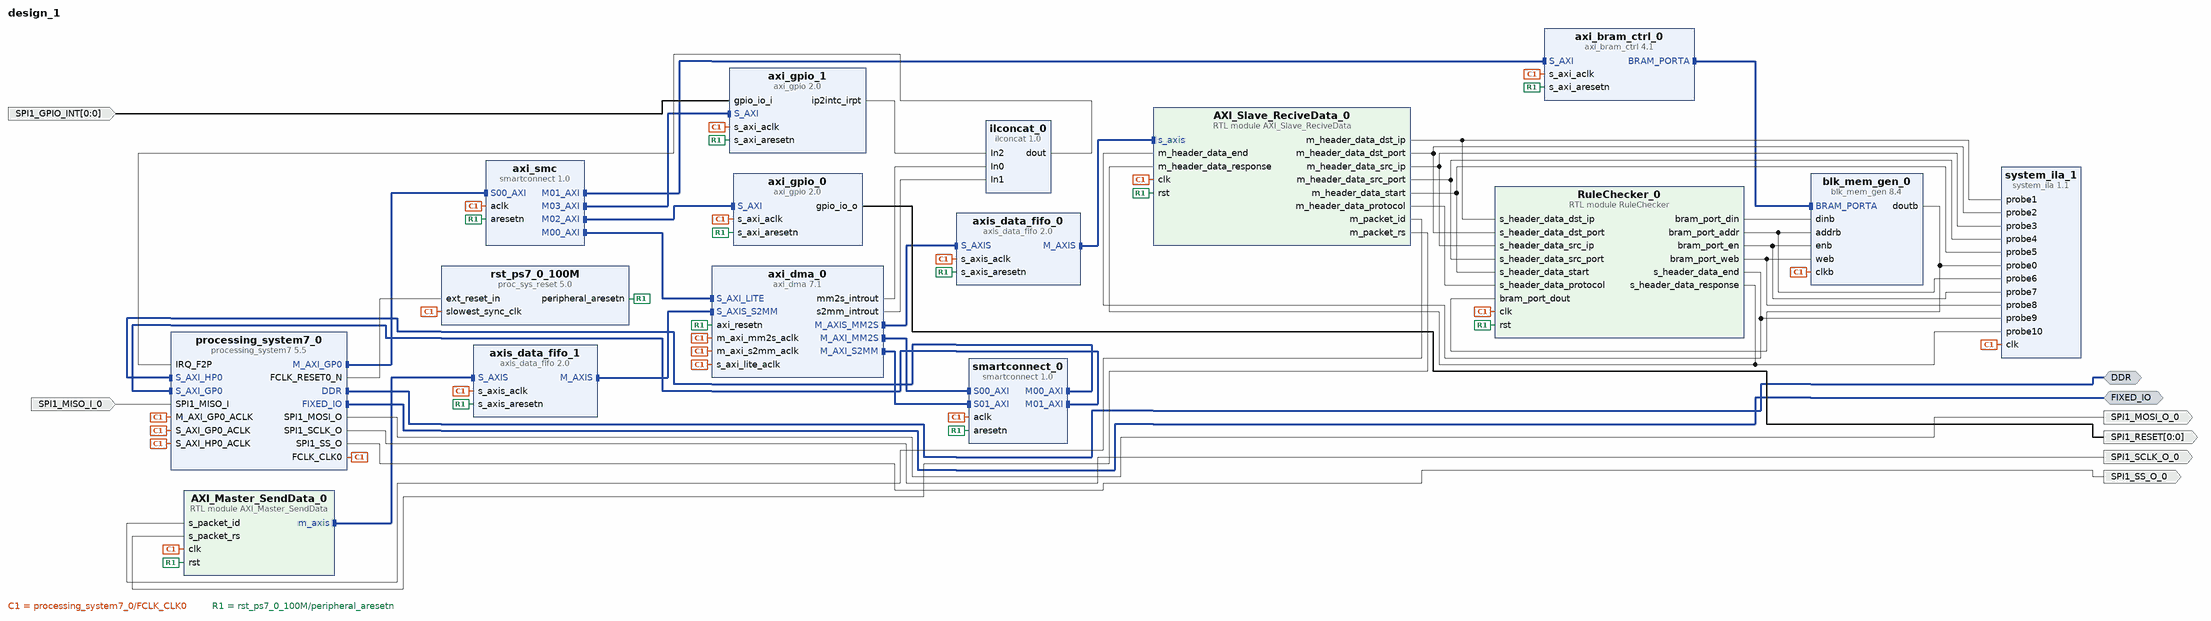
[diagram p0: block diagram of the top level]
# Vivado block design design_1, xc7z020clg400-1, Vivado 2025.1
create_bd_design design_1

create_bd_intf_port -mode Master -vlnv xilinx.com:interface:ddrx_rtl:1.0 DDR
create_bd_intf_port -mode Master -vlnv xilinx.com:display_processing_system7:fixedio_rtl:1.0 FIXED_IO
create_bd_port -dir O SPI1_SCLK_O_0
create_bd_port -dir O SPI1_MOSI_O_0
create_bd_port -dir O SPI1_SS_O_0
create_bd_port -dir O -from 0 -to 0 SPI1_RESET
create_bd_port -dir I -from 0 -to 0 SPI1_GPIO_INT
create_bd_port -dir I SPI1_MISO_I_0

create_bd_cell -type ip -vlnv xilinx.com:ip:processing_system7:5.5 processing_system7_0
set_property -dict [list \
  CONFIG.PCW_APU_PERIPHERAL_FREQMHZ 650 \
  CONFIG.PCW_CRYSTAL_PERIPHERAL_FREQMHZ 50 \
  CONFIG.PCW_ENET0_ENET0_IO {MIO 16 .. 27} \
  CONFIG.PCW_ENET0_GRP_MDIO_ENABLE 1 \
  CONFIG.PCW_ENET0_GRP_MDIO_IO {MIO 52 .. 53} \
  CONFIG.PCW_ENET0_PERIPHERAL_ENABLE 1 \
  CONFIG.PCW_ENET0_RESET_ENABLE 1 \
  CONFIG.PCW_ENET0_RESET_IO {MIO 9} \
  CONFIG.PCW_ENET_RESET_ENABLE 1 \
  CONFIG.PCW_ENET_RESET_SELECT {Share reset pin} \
  CONFIG.PCW_FPGA0_PERIPHERAL_FREQMHZ 100 \
  CONFIG.PCW_FPGA1_PERIPHERAL_FREQMHZ 50 \
  CONFIG.PCW_GPIO_MIO_GPIO_ENABLE 1 \
  CONFIG.PCW_GPIO_MIO_GPIO_IO MIO \
  CONFIG.PCW_I2C_RESET_ENABLE 1 \
  CONFIG.PCW_IRQ_F2P_INTR 1 \
  CONFIG.PCW_M_AXI_GP0_FREQMHZ 10 \
  CONFIG.PCW_PERIPHERAL_BOARD_PRESET part0 \
  CONFIG.PCW_PRESET_BANK1_VOLTAGE {LVCMOS 1.8V} \
  CONFIG.PCW_QSPI_GRP_FBCLK_ENABLE 1 \
  CONFIG.PCW_QSPI_GRP_FBCLK_IO {MIO 8} \
  CONFIG.PCW_QSPI_GRP_SINGLE_SS_ENABLE 1 \
  CONFIG.PCW_QSPI_GRP_SINGLE_SS_IO {MIO 1 .. 6} \
  CONFIG.PCW_QSPI_PERIPHERAL_ENABLE 1 \
  CONFIG.PCW_QSPI_QSPI_IO {MIO 1 .. 6} \
  CONFIG.PCW_SD0_GRP_CD_ENABLE 1 \
  CONFIG.PCW_SD0_GRP_CD_IO {MIO 47} \
  CONFIG.PCW_SD0_GRP_WP_ENABLE 0 \
  CONFIG.PCW_SD0_PERIPHERAL_ENABLE 1 \
  CONFIG.PCW_SD0_SD0_IO {MIO 40 .. 45} \
  CONFIG.PCW_SDIO_PERIPHERAL_FREQMHZ 50 \
  CONFIG.PCW_SINGLE_QSPI_DATA_MODE x4 \
  CONFIG.PCW_SPI1_PERIPHERAL_ENABLE 1 \
  CONFIG.PCW_SPI1_SPI1_IO EMIO \
  CONFIG.PCW_UART0_PERIPHERAL_ENABLE 1 \
  CONFIG.PCW_UART0_UART0_IO {MIO 14 .. 15} \
  CONFIG.PCW_UART1_PERIPHERAL_ENABLE 0 \
  CONFIG.PCW_UART_PERIPHERAL_FREQMHZ 100 \
  CONFIG.PCW_UIPARAM_DDR_BUS_WIDTH {16 Bit} \
  CONFIG.PCW_UIPARAM_DDR_FREQ_MHZ 525 \
  CONFIG.PCW_UIPARAM_DDR_PARTNO {MT41J256M16 RE-125} \
  CONFIG.PCW_USB0_PERIPHERAL_ENABLE 1 \
  CONFIG.PCW_USB0_RESET_ENABLE 1 \
  CONFIG.PCW_USB0_RESET_IO {MIO 46} \
  CONFIG.PCW_USB0_USB0_IO {MIO 28 .. 39} \
  CONFIG.PCW_USB_RESET_ENABLE 1 \
  CONFIG.PCW_USB_RESET_SELECT {Share reset pin} \
  CONFIG.PCW_USE_FABRIC_INTERRUPT 1 \
  CONFIG.PCW_USE_S_AXI_GP0 1 \
  CONFIG.PCW_USE_S_AXI_HP0 1 \
  CONFIG.preset None \
] [get_bd_cells processing_system7_0]
# 511 more settings of processing_system7_0 are not shown: defaults, MIO pin electricals, DDR timing, and values the tool derives
create_bd_cell -type ip -vlnv xilinx.com:ip:axi_dma:7.1 axi_dma_0
set_property -dict {CONFIG.c_include_s2mm 1 CONFIG.c_include_sg 0} [get_bd_cells axi_dma_0]
create_bd_cell -type ip -vlnv xilinx.com:ip:smartconnect:1.0 axi_smc
set_property -dict {CONFIG.NUM_MI 4 CONFIG.NUM_SI 1} [get_bd_cells axi_smc]
create_bd_cell -type ip -vlnv xilinx.com:ip:proc_sys_reset:5.0 rst_ps7_0_100M
create_bd_cell -type ip -vlnv xilinx.com:ip:smartconnect:1.0 smartconnect_0
set_property -dict {CONFIG.NUM_MI 2 CONFIG.NUM_SI 2} [get_bd_cells smartconnect_0]
create_bd_cell -type module -reference AXI_Slave_ReciveData AXI_Slave_ReciveData_0
create_bd_cell -type module -reference RuleChecker RuleChecker_0
create_bd_cell -type ip -vlnv xilinx.com:ip:axi_bram_ctrl:4.1 axi_bram_ctrl_0
set_property -dict {CONFIG.READ_LATENCY 2 CONFIG.SINGLE_PORT_BRAM 1} [get_bd_cells axi_bram_ctrl_0]
create_bd_cell -type ip -vlnv xilinx.com:ip:blk_mem_gen:8.4 blk_mem_gen_0
set_property -dict [list \
  CONFIG.Assume_Synchronous_Clk true \
  CONFIG.Memory_Type True_Dual_Port_RAM \
  CONFIG.Operating_Mode_B READ_FIRST \
  CONFIG.use_bram_block Stand_Alone \
] [get_bd_cells blk_mem_gen_0]
create_bd_cell -type ip -vlnv xilinx.com:ip:axis_data_fifo:2.0 axis_data_fifo_0
create_bd_cell -type ip -vlnv xilinx.com:ip:axis_data_fifo:2.0 axis_data_fifo_1
set_property -dict {CONFIG.HAS_TLAST 1 CONFIG.TDATA_NUM_BYTES 4} [get_bd_cells axis_data_fifo_1]
create_bd_cell -type module -reference AXI_Master_SendData AXI_Master_SendData_0
create_bd_cell -type inline_hdl -vlnv xilinx.com:inline_hdl:ilconcat:1.0 ilconcat_0
set_property -dict {CONFIG.NUM_PORTS 3} [get_bd_cells ilconcat_0]
create_bd_cell -type ip -vlnv xilinx.com:ip:axi_gpio:2.0 axi_gpio_0
set_property -dict [list \
  CONFIG.C_ALL_OUTPUTS 1 \
  CONFIG.C_DOUT_DEFAULT 0x00000001 \
  CONFIG.C_GPIO_WIDTH 1 \
  CONFIG.C_INTERRUPT_PRESENT 0 \
] [get_bd_cells axi_gpio_0]
create_bd_cell -type ip -vlnv xilinx.com:ip:axi_gpio:2.0 axi_gpio_1
set_property -dict {CONFIG.C_ALL_INPUTS 1 CONFIG.C_GPIO_WIDTH 1 CONFIG.C_INTERRUPT_PRESENT 1} [get_bd_cells axi_gpio_1]
create_bd_cell -type ip -vlnv xilinx.com:ip:system_ila:1.1 system_ila_1
set_property -dict [list \
  CONFIG.C_MON_TYPE NATIVE \
  CONFIG.C_NUM_OF_PROBES 11 \
  CONFIG.C_PROBE0_TYPE 0 \
  CONFIG.C_PROBE10_TYPE 0 \
  CONFIG.C_PROBE1_TYPE 0 \
  CONFIG.C_PROBE2_TYPE 0 \
  CONFIG.C_PROBE3_TYPE 0 \
  CONFIG.C_PROBE4_TYPE 0 \
  CONFIG.C_PROBE5_TYPE 0 \
  CONFIG.C_PROBE6_TYPE 0 \
  CONFIG.C_PROBE7_TYPE 0 \
  CONFIG.C_PROBE8_TYPE 0 \
  CONFIG.C_PROBE9_TYPE 0 \
] [get_bd_cells system_ila_1]

# ---- connections ----

connect_bd_intf_net [get_bd_intf_pins AXI_Master_SendData_0/m_axis] [get_bd_intf_pins axis_data_fifo_1/S_AXIS]
connect_bd_intf_net [get_bd_intf_pins axi_bram_ctrl_0/BRAM_PORTA] [get_bd_intf_pins blk_mem_gen_0/BRAM_PORTA]
connect_bd_intf_net [get_bd_intf_pins axi_dma_0/M_AXIS_MM2S] [get_bd_intf_pins axis_data_fifo_0/S_AXIS]
connect_bd_intf_net [get_bd_intf_pins axi_dma_0/M_AXI_MM2S] [get_bd_intf_pins smartconnect_0/S00_AXI]
connect_bd_intf_net [get_bd_intf_pins axi_dma_0/M_AXI_S2MM] [get_bd_intf_pins smartconnect_0/S01_AXI]
connect_bd_intf_net -intf_net axi_fifo_mm_s_0_AXI_STR_TXD [get_bd_intf_pins axis_data_fifo_0/M_AXIS] [get_bd_intf_pins AXI_Slave_ReciveData_0/s_axis]
connect_bd_intf_net [get_bd_intf_pins axi_smc/M00_AXI] [get_bd_intf_pins axi_dma_0/S_AXI_LITE]
connect_bd_intf_net [get_bd_intf_pins axi_smc/M01_AXI] [get_bd_intf_pins axi_bram_ctrl_0/S_AXI]
connect_bd_intf_net [get_bd_intf_pins axi_smc/M02_AXI] [get_bd_intf_pins axi_gpio_0/S_AXI]
connect_bd_intf_net [get_bd_intf_pins axi_smc/M03_AXI] [get_bd_intf_pins axi_gpio_1/S_AXI]
connect_bd_intf_net [get_bd_intf_pins axi_dma_0/S_AXIS_S2MM] [get_bd_intf_pins axis_data_fifo_1/M_AXIS]
connect_bd_intf_net [get_bd_intf_ports DDR] [get_bd_intf_pins processing_system7_0/DDR]
connect_bd_intf_net [get_bd_intf_ports FIXED_IO] [get_bd_intf_pins processing_system7_0/FIXED_IO]
connect_bd_intf_net [get_bd_intf_pins processing_system7_0/M_AXI_GP0] [get_bd_intf_pins axi_smc/S00_AXI]
connect_bd_intf_net [get_bd_intf_pins smartconnect_0/M00_AXI] [get_bd_intf_pins processing_system7_0/S_AXI_HP0]
connect_bd_intf_net [get_bd_intf_pins smartconnect_0/M01_AXI] [get_bd_intf_pins processing_system7_0/S_AXI_GP0]
connect_bd_net -net AXI_Slave_ReciveData_0_m_header_data_dst_ip [get_bd_pins AXI_Slave_ReciveData_0/m_header_data_dst_ip] \
  [get_bd_pins RuleChecker_0/s_header_data_dst_ip] [get_bd_pins system_ila_1/probe1]
connect_bd_net -net AXI_Slave_ReciveData_0_m_header_data_dst_port [get_bd_pins AXI_Slave_ReciveData_0/m_header_data_dst_port] \
  [get_bd_pins RuleChecker_0/s_header_data_dst_port] [get_bd_pins system_ila_1/probe2]
connect_bd_net [get_bd_pins AXI_Slave_ReciveData_0/m_header_data_protocol] [get_bd_pins RuleChecker_0/s_header_data_protocol]
connect_bd_net -net AXI_Slave_ReciveData_0_m_header_data_src_ip [get_bd_pins AXI_Slave_ReciveData_0/m_header_data_src_ip] \
  [get_bd_pins RuleChecker_0/s_header_data_src_ip] [get_bd_pins system_ila_1/probe3]
connect_bd_net -net AXI_Slave_ReciveData_0_m_header_data_src_port [get_bd_pins AXI_Slave_ReciveData_0/m_header_data_src_port] \
  [get_bd_pins RuleChecker_0/s_header_data_src_port] [get_bd_pins system_ila_1/probe4]
connect_bd_net -net AXI_Slave_ReciveData_0_m_header_data_start [get_bd_pins AXI_Slave_ReciveData_0/m_header_data_start] \
  [get_bd_pins RuleChecker_0/s_header_data_start] [get_bd_pins system_ila_1/probe5]
connect_bd_net [get_bd_pins AXI_Slave_ReciveData_0/m_packet_id] [get_bd_pins AXI_Master_SendData_0/s_packet_id]
connect_bd_net [get_bd_pins AXI_Slave_ReciveData_0/m_packet_rs] [get_bd_pins AXI_Master_SendData_0/s_packet_rs]
connect_bd_net -net RuleChecker_0_bram_port_addr [get_bd_pins RuleChecker_0/bram_port_addr] \
  [get_bd_pins blk_mem_gen_0/addrb] [get_bd_pins system_ila_1/probe6]
connect_bd_net [get_bd_pins RuleChecker_0/bram_port_din] [get_bd_pins blk_mem_gen_0/dinb]
connect_bd_net -net RuleChecker_0_bram_port_en [get_bd_pins RuleChecker_0/bram_port_en] \
  [get_bd_pins blk_mem_gen_0/enb] [get_bd_pins system_ila_1/probe7]
connect_bd_net -net RuleChecker_0_bram_port_web [get_bd_pins RuleChecker_0/bram_port_web] \
  [get_bd_pins blk_mem_gen_0/web] [get_bd_pins system_ila_1/probe8]
connect_bd_net -net RuleChecker_0_s_header_data_end [get_bd_pins RuleChecker_0/s_header_data_end] \
  [get_bd_pins AXI_Slave_ReciveData_0/m_header_data_end] [get_bd_pins system_ila_1/probe9]
connect_bd_net -net RuleChecker_0_s_header_data_response [get_bd_pins RuleChecker_0/s_header_data_response] \
  [get_bd_pins AXI_Slave_ReciveData_0/m_header_data_response] [get_bd_pins system_ila_1/probe10]
connect_bd_net [get_bd_ports SPI1_GPIO_INT] [get_bd_pins axi_gpio_1/gpio_io_i]
connect_bd_net -net SPI1_MISO_I_0_1 [get_bd_ports SPI1_MISO_I_0] [get_bd_pins processing_system7_0/SPI1_MISO_I]
connect_bd_net [get_bd_pins axi_dma_0/mm2s_introut] [get_bd_pins ilconcat_0/In0]
connect_bd_net [get_bd_pins axi_dma_0/s2mm_introut] [get_bd_pins ilconcat_0/In1]
connect_bd_net [get_bd_pins axi_gpio_0/gpio_io_o] [get_bd_ports SPI1_RESET]
connect_bd_net [get_bd_pins axi_gpio_1/ip2intc_irpt] [get_bd_pins ilconcat_0/In2]
connect_bd_net -net blk_mem_gen_0_doutb [get_bd_pins blk_mem_gen_0/doutb] [get_bd_pins RuleChecker_0/bram_port_dout] [get_bd_pins system_ila_1/probe0]
connect_bd_net [get_bd_pins ilconcat_0/dout] [get_bd_pins processing_system7_0/IRQ_F2P]
connect_bd_net [get_bd_pins processing_system7_0/FCLK_CLK0] \
  [get_bd_pins processing_system7_0/M_AXI_GP0_ACLK] [get_bd_pins axi_smc/aclk] [get_bd_pins axi_dma_0/s_axi_lite_aclk] \
  [get_bd_pins rst_ps7_0_100M/slowest_sync_clk] [get_bd_pins axi_dma_0/m_axi_mm2s_aclk] \
  [get_bd_pins processing_system7_0/S_AXI_GP0_ACLK] [get_bd_pins processing_system7_0/S_AXI_HP0_ACLK] \
  [get_bd_pins smartconnect_0/aclk] [get_bd_pins axi_bram_ctrl_0/s_axi_aclk] [get_bd_pins blk_mem_gen_0/clkb] \
  [get_bd_pins axis_data_fifo_0/s_axis_aclk] [get_bd_pins axi_dma_0/m_axi_s2mm_aclk] \
  [get_bd_pins axis_data_fifo_1/s_axis_aclk] [get_bd_pins AXI_Master_SendData_0/clk] [get_bd_pins axi_gpio_0/s_axi_aclk] \
  [get_bd_pins axi_gpio_1/s_axi_aclk] [get_bd_pins AXI_Slave_ReciveData_0/clk] [get_bd_pins RuleChecker_0/clk] \
  [get_bd_pins system_ila_1/clk]
connect_bd_net [get_bd_pins processing_system7_0/FCLK_RESET0_N] [get_bd_pins rst_ps7_0_100M/ext_reset_in]
connect_bd_net [get_bd_pins processing_system7_0/SPI1_MOSI_O] [get_bd_ports SPI1_MOSI_O_0]
connect_bd_net [get_bd_pins processing_system7_0/SPI1_SCLK_O] [get_bd_ports SPI1_SCLK_O_0]
connect_bd_net [get_bd_pins processing_system7_0/SPI1_SS_O] [get_bd_ports SPI1_SS_O_0]
connect_bd_net [get_bd_pins rst_ps7_0_100M/peripheral_aresetn] \
  [get_bd_pins axi_dma_0/axi_resetn] [get_bd_pins axi_smc/aresetn] [get_bd_pins smartconnect_0/aresetn] \
  [get_bd_pins axi_bram_ctrl_0/s_axi_aresetn] [get_bd_pins axis_data_fifo_0/s_axis_aresetn] \
  [get_bd_pins axis_data_fifo_1/s_axis_aresetn] [get_bd_pins AXI_Master_SendData_0/rst] \
  [get_bd_pins axi_gpio_0/s_axi_aresetn] [get_bd_pins axi_gpio_1/s_axi_aresetn] [get_bd_pins AXI_Slave_ReciveData_0/rst] \
  [get_bd_pins RuleChecker_0/rst]
set_property HDL_ATTRIBUTE.BMM_INFO_PROCESSOR {arm > design_1 axi_bram_ctrl_0} [get_bd_cells processing_system7_0]
set_property HDL_ATTRIBUTE.KEEP_HIERARCHY yes [get_bd_cells processing_system7_0]
set_property HDL_ATTRIBUTE.BMM_INFO_ADDRESS_SPACE {byte  0x40000000 32 > design_1 blk_mem_gen_0} [get_bd_cells axi_bram_ctrl_0]
set_property HDL_ATTRIBUTE.KEEP_HIERARCHY yes [get_bd_cells axi_bram_ctrl_0]
set_property HDL_ATTRIBUTE.DEBUG true [get_bd_nets AXI_Slave_ReciveData_0_m_header_data_dst_ip]
set_property HDL_ATTRIBUTE.MARK_DEBUG true [get_bd_nets AXI_Slave_ReciveData_0_m_header_data_dst_ip]
set_property HDL_ATTRIBUTE.DEBUG true [get_bd_nets AXI_Slave_ReciveData_0_m_header_data_dst_port]
set_property HDL_ATTRIBUTE.MARK_DEBUG true [get_bd_nets AXI_Slave_ReciveData_0_m_header_data_dst_port]
set_property HDL_ATTRIBUTE.DEBUG true [get_bd_nets AXI_Slave_ReciveData_0_m_header_data_src_ip]
set_property HDL_ATTRIBUTE.MARK_DEBUG true [get_bd_nets AXI_Slave_ReciveData_0_m_header_data_src_ip]
set_property HDL_ATTRIBUTE.DEBUG true [get_bd_nets AXI_Slave_ReciveData_0_m_header_data_src_port]
set_property HDL_ATTRIBUTE.MARK_DEBUG true [get_bd_nets AXI_Slave_ReciveData_0_m_header_data_src_port]
set_property HDL_ATTRIBUTE.DEBUG true [get_bd_nets AXI_Slave_ReciveData_0_m_header_data_start]
set_property HDL_ATTRIBUTE.MARK_DEBUG true [get_bd_nets AXI_Slave_ReciveData_0_m_header_data_start]
set_property HDL_ATTRIBUTE.DEBUG true [get_bd_nets RuleChecker_0_bram_port_addr]
set_property HDL_ATTRIBUTE.MARK_DEBUG true [get_bd_nets RuleChecker_0_bram_port_addr]
set_property HDL_ATTRIBUTE.DEBUG true [get_bd_nets RuleChecker_0_bram_port_en]
set_property HDL_ATTRIBUTE.MARK_DEBUG true [get_bd_nets RuleChecker_0_bram_port_en]
set_property HDL_ATTRIBUTE.DEBUG true [get_bd_nets RuleChecker_0_bram_port_web]
set_property HDL_ATTRIBUTE.MARK_DEBUG true [get_bd_nets RuleChecker_0_bram_port_web]
set_property HDL_ATTRIBUTE.DEBUG true [get_bd_nets RuleChecker_0_s_header_data_end]
set_property HDL_ATTRIBUTE.MARK_DEBUG true [get_bd_nets RuleChecker_0_s_header_data_end]
set_property HDL_ATTRIBUTE.DEBUG true [get_bd_nets RuleChecker_0_s_header_data_response]
set_property HDL_ATTRIBUTE.MARK_DEBUG true [get_bd_nets RuleChecker_0_s_header_data_response]
set_property HDL_ATTRIBUTE.DEBUG true [get_bd_nets blk_mem_gen_0_doutb]
set_property HDL_ATTRIBUTE.MARK_DEBUG true [get_bd_nets blk_mem_gen_0_doutb]

# ---- address map ----
assign_bd_address -offset 0x00000000 -range 256M -target_address_space [get_bd_addr_spaces axi_dma_0/Data_MM2S] [get_bd_addr_segs processing_system7_0/S_AXI_GP0/GP0_DDR_LOWOCM]
assign_bd_address -offset 0x10000000 -range 256M -target_address_space [get_bd_addr_spaces axi_dma_0/Data_MM2S] [get_bd_addr_segs processing_system7_0/S_AXI_HP0/HP0_DDR_LOWOCM]
assign_bd_address -offset 0xFC000000 -range 16M -target_address_space [get_bd_addr_spaces axi_dma_0/Data_MM2S] [get_bd_addr_segs processing_system7_0/S_AXI_GP0/GP0_QSPI_LINEAR]
exclude_bd_addr_seg -offset 0x40000000 -range 1G -target_address_space [get_bd_addr_spaces axi_dma_0/Data_MM2S] [get_bd_addr_segs processing_system7_0/S_AXI_GP0/GP0_M_AXI_GP0]
exclude_bd_addr_seg -offset 0xE0000000 -range 4M -target_address_space [get_bd_addr_spaces axi_dma_0/Data_MM2S] [get_bd_addr_segs processing_system7_0/S_AXI_GP0/GP0_IOP]
assign_bd_address -offset 0x00000000 -range 256M -target_address_space [get_bd_addr_spaces axi_dma_0/Data_S2MM] [get_bd_addr_segs processing_system7_0/S_AXI_GP0/GP0_DDR_LOWOCM]
assign_bd_address -offset 0x10000000 -range 256M -target_address_space [get_bd_addr_spaces axi_dma_0/Data_S2MM] [get_bd_addr_segs processing_system7_0/S_AXI_HP0/HP0_DDR_LOWOCM]
assign_bd_address -offset 0xFC000000 -range 16M -target_address_space [get_bd_addr_spaces axi_dma_0/Data_S2MM] [get_bd_addr_segs processing_system7_0/S_AXI_GP0/GP0_QSPI_LINEAR]
exclude_bd_addr_seg -offset 0x40000000 -range 1G -target_address_space [get_bd_addr_spaces axi_dma_0/Data_S2MM] [get_bd_addr_segs processing_system7_0/S_AXI_GP0/GP0_M_AXI_GP0]
exclude_bd_addr_seg -offset 0xE0000000 -range 4M -target_address_space [get_bd_addr_spaces axi_dma_0/Data_S2MM] [get_bd_addr_segs processing_system7_0/S_AXI_GP0/GP0_IOP]
assign_bd_address -offset 0x40000000 -range 8K -target_address_space [get_bd_addr_spaces processing_system7_0/Data] [get_bd_addr_segs axi_bram_ctrl_0/S_AXI/Mem0]
assign_bd_address -offset 0x40400000 -range 64K -target_address_space [get_bd_addr_spaces processing_system7_0/Data] [get_bd_addr_segs axi_dma_0/S_AXI_LITE/Reg]
assign_bd_address -offset 0x41200000 -range 64K -target_address_space [get_bd_addr_spaces processing_system7_0/Data] [get_bd_addr_segs axi_gpio_0/S_AXI/Reg]
assign_bd_address -offset 0x41210000 -range 64K -target_address_space [get_bd_addr_spaces processing_system7_0/Data] [get_bd_addr_segs axi_gpio_1/S_AXI/Reg]

validate_bd_design
save_bd_design
